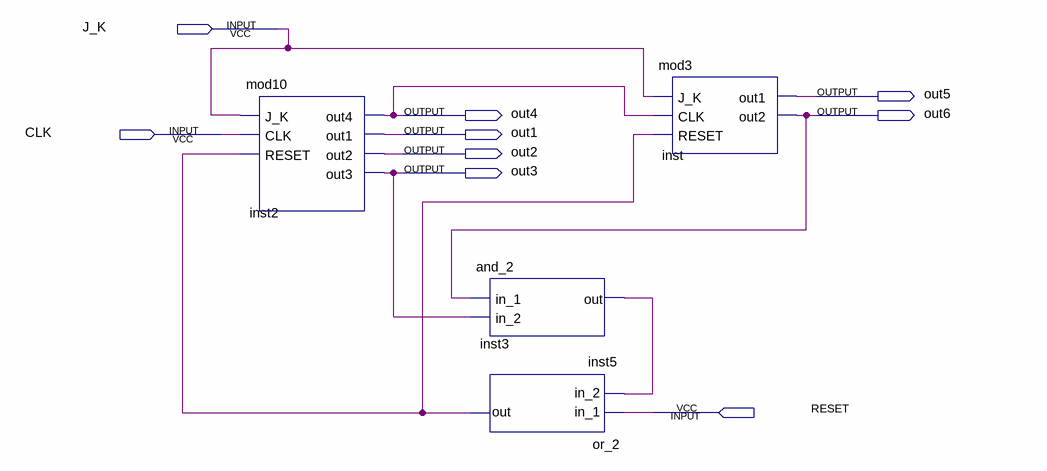
[diagram p0: schematic sheet]
// Quartus schematic mod24.bdf as structural Verilog: 4 symbols, 9 pins
module mod24 (
  input  J_K,
  input  CLK,
  input  RESET,
  output out5,
  output out4,
  output out6,
  output out1,
  output out2,
  output out3
);

  wire inst3_out, inst5_out;

  mod10 inst2 (.J_K(J_K), .CLK(CLK), .RESET(inst5_out), .out4(out4), .out1(out1), .out2(out2), .out3(out3));
  and_2 inst3 (.in_1(out6), .in_2(out3), .out(inst3_out));
  or_2 inst5 (.in_1(RESET), .in_2(inst3_out), .out(inst5_out));
  mod3 inst (.J_K(J_K), .CLK(out4), .RESET(inst5_out), .out1(out5), .out2(out6));
endmodule
